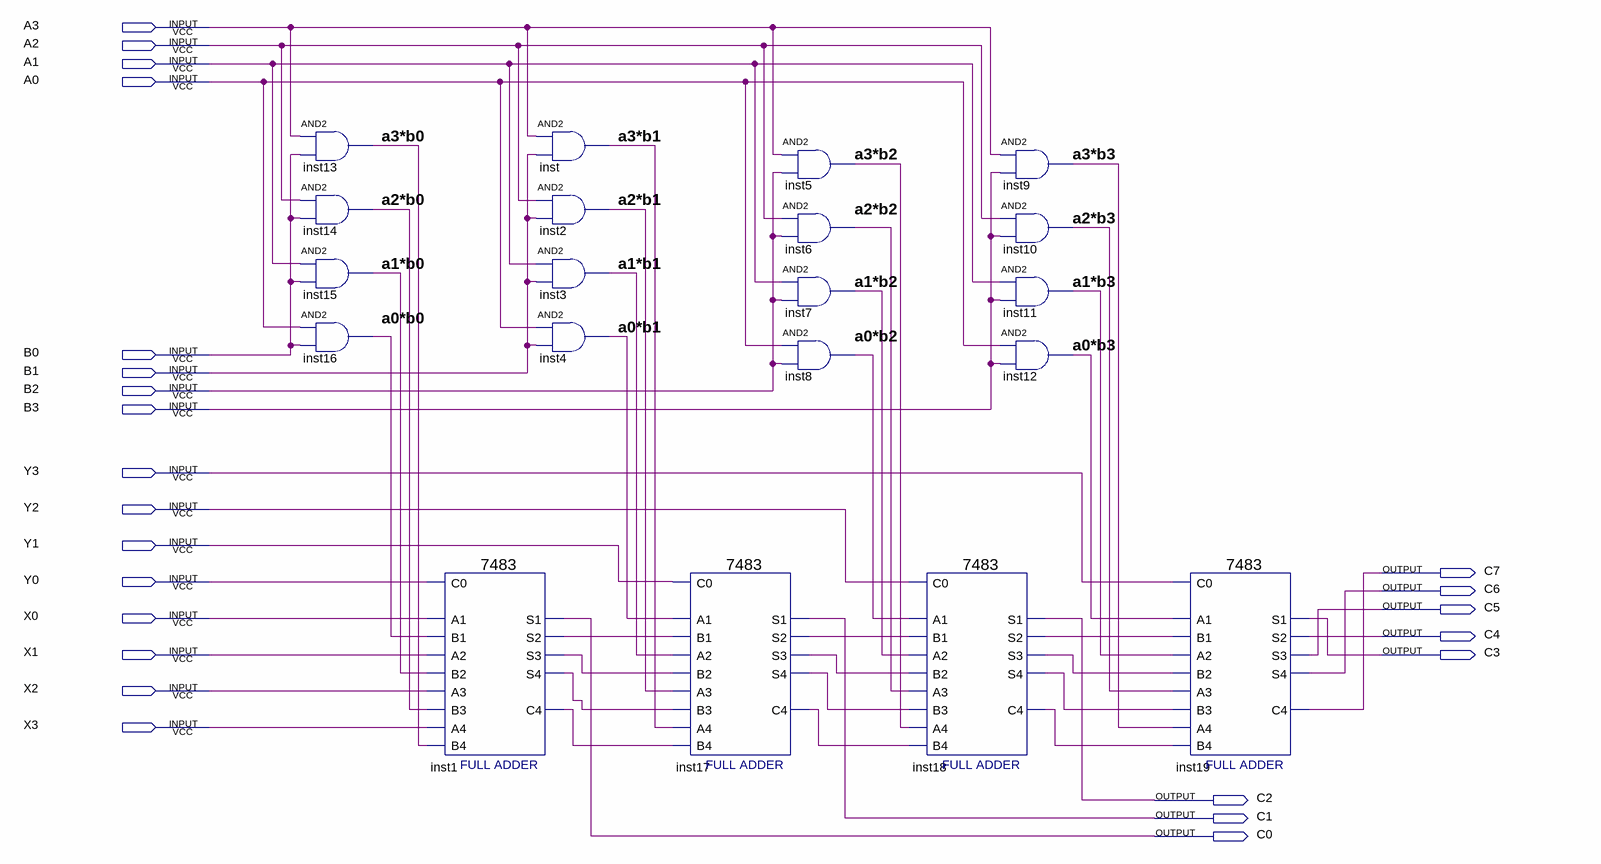
[diagram p0: schematic sheet]
// Quartus schematic MSB4_4.bdf as structural Verilog: 20 symbols, 24 pins
module MSB4_4 (
  input  A3,
  input  A2,
  input  A1,
  input  A0,
  input  B0,
  input  B1,
  input  B2,
  input  B3,
  input  Y3,
  input  Y2,
  input  Y1,
  input  Y0,
  input  X0,
  input  X1,
  input  X2,
  input  X3,
  output C7,
  output C6,
  output C5,
  output C4,
  output C3,
  output C2,
  output C1,
  output C0
);

  wire inst1_c4, inst1_s2, inst1_s3, inst1_s4, inst2_out, inst3_out, inst4_out, inst5_out, inst6_out,
       inst7_out, inst8_out, inst9_out, inst10_out, inst11_out, inst12_out, inst13_out, inst14_out,
       inst15_out, inst16_out, inst17_c4, inst17_s2, inst17_s3, inst17_s4, inst18_c4, inst18_s2, inst18_s3,
       inst18_s4, inst_out;

  and inst13 (inst13_out, A3, B0);
  and inst14 (inst14_out, A2, B0);
  and inst15 (inst15_out, A1, B0);
  and inst16 (inst16_out, A0, B0);
  \7483  inst1 (
    .B4(inst13_out), .C0(Y0), .A1(X0), .A2(X1), .B1(inst16_out), .B2(inst15_out), .A3(X2), .B3(inst14_out),
    .A4(X3), .S3(inst1_s3), .S4(inst1_s4), .S2(inst1_s2), .C4(inst1_c4), .S1(C0));
  and inst (inst_out, A3, B1);
  and inst2 (inst2_out, A2, B1);
  and inst3 (inst3_out, A1, B1);
  and inst4 (inst4_out, A0, B1);
  \7483  inst17 (
    .B4(inst1_c4), .C0(Y1), .A1(inst4_out), .A2(inst3_out), .B1(inst1_s2), .B2(inst1_s3), .A3(inst2_out),
    .B3(inst1_s4), .A4(inst_out), .S3(inst17_s3), .S4(inst17_s4), .S2(inst17_s2), .C4(inst17_c4), .S1(C1));
  and inst5 (inst5_out, A3, B2);
  and inst6 (inst6_out, A2, B2);
  and inst7 (inst7_out, A1, B2);
  and inst8 (inst8_out, A0, B2);
  \7483  inst18 (
    .B4(inst17_c4), .C0(Y2), .A1(inst8_out), .A2(inst7_out), .B1(inst17_s2), .B2(inst17_s3), .A3(inst6_out),
    .B3(inst17_s4), .A4(inst5_out), .S3(inst18_s3), .S4(inst18_s4), .S2(inst18_s2), .C4(inst18_c4), .S1(C2));
  and inst9 (inst9_out, A3, B3);
  and inst10 (inst10_out, A2, B3);
  and inst11 (inst11_out, A1, B3);
  and inst12 (inst12_out, A0, B3);
  \7483  inst19 (
    .B4(inst18_c4), .C0(Y3), .A1(inst12_out), .A2(inst11_out), .B1(inst18_s2), .B2(inst18_s3),
    .A3(inst10_out), .B3(inst18_s4), .A4(inst9_out), .S3(C5), .S4(C6), .S2(C4), .C4(C7), .S1(C3));

  // Notes on the sheet:
  //   a3*b0
  //   a3*b1
  //   a3*b2
  //   a3*b3
  //   a2*b0
  //   a2*b1
  //   a2*b2
  //   a2*b3
  //   a1*b0
  //   a1*b1
  //   a1*b2
  //   a1*b3
  //   a0*b0
  //   a0*b1
  //   a0*b2
  //   a0*b3
endmodule
